# EAGLE design esp32_LoRa_radar_pelampung (EAGLE 9.6.0)
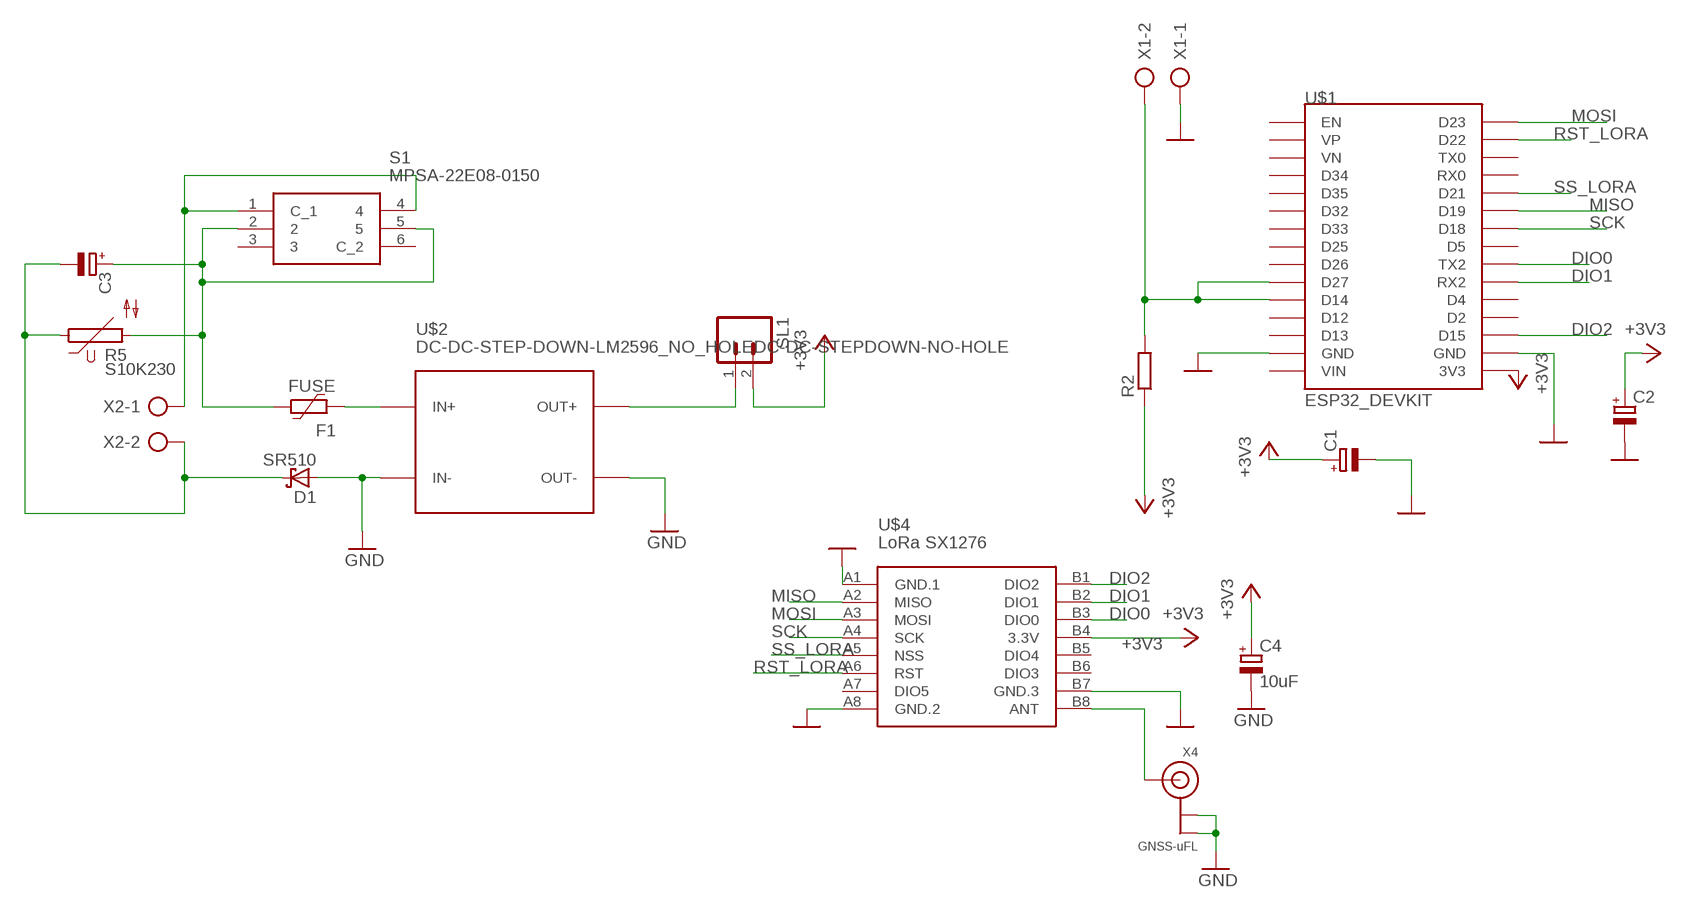
[diagram p0: schematic, sheet 1]

## Parts
C1  CPOL-EUE5-8.5  [E5-8,5]
C2  CPOL-EUE5-8.5  [E5-8,5]
C3  CPOL-EUE5-13  [E5-13]
C4  10uF  CPOL-EUE2.5-6  [E2,5-6]
D1  SR510  SCHOTTKY-DIODESMD  [SMB]
F1  FUSE  1812L010  [1812L]
R2  R-EU_0309/12  [0309/12]
R5  S10K230  [S10K230]
S1  MPSA-22E08-0150  [MPSA22E080150]
SL1  M02  [02P]
U$1  ESP32_DEVKIT  [ESP32_DEVKIT]
U$2  DC-DC-STEP-DOWN-LM2596_NO_HOLEDC-DC-STEPDOWN-NO-HOLE  [DC-DC-STEP-DOWN-LM2596_NO_HOLE]
U$4  LoRa SX1276  WIRELESS-LORA-RFM95W#SMD  [WIRELESS-LORA-RFM95W#SMD]
X1  AK300/2  [AK300/2]
X2  AK300/2  [AK300/2]
X4  GNSS-uFL  ANTENNA_U.FL  [U.FL]

## Nets
+3V3: C1.+ C2.+ C4.+ R2.1 SL1.2 U$1.3V3 U$4.B4(3.3V)
DIO0: U$1.TX2 U$4.B3(DIO0)
DIO1: U$1.RX2 U$4.B2(DIO1)
DIO2: U$1.D15 U$4.B1(DIO2)
GND: C1.- C2.- C4.- D1.A U$1.GND@1(GND) U$1.GND@2(GND) U$2.IN- U$2.OUT- U$4.A1(GND.1) U$4.A8(GND.2) U$4.B7(GND.3) X1.1 X4.1(GND) X4.2(GND)
MISO: U$1.D19 U$4.A2(MISO)
MOSI: U$1.D23 U$4.A3(MOSI)
N$2: F1.2 U$2.IN+
N$3: SL1.1 U$2.OUT+
N$4: R2.2 U$1.D14 U$1.D27 X1.2
N$6: C3.- D1.C R5.1 X2.2
N$7: S1.1(C_1) S1.4 X2.1
N$8: C3.+ F1.1 R5.2 S1.2 S1.5
N$37: U$4.B8(ANT) X4.3(SIGNAL)
RST_LORA: U$1.D22 U$4.A6(RST)
SCK: U$1.D18 U$4.A4(SCK)
SS_LORA: U$1.D21 U$4.A5(NSS)
Unconnected: S1.3 S1.6(C_2) U$1.D2 U$1.D4 U$1.D5 U$1.D12 U$1.D13 U$1.D25 U$1.D26 U$1.D32 U$1.D33 U$1.D34 U$1.D35 U$1.EN U$1.RX0 U$1.TX0 U$1.VIN U$1.VN U$1.VP U$4.A7(DIO5) U$4.B5(DIO4) U$4.B6(DIO3)

## Library data of the parts
C1-C4 = rcl:CPOL-EU: POLARIZED CAPACITOR, European symbol; SPICEPREFIX: C
D1 = diode:SCHOTTKY-DIODE: Schottky Diode
F1 = polyfuse-smd_10:?: Polyfuse Resettable PTC Source: http://www.littelfuse.com/products/resettable-ptcs.aspx; MF: Littelfuse; MPN: 1812L010; OC_FARNELL: 1822210; OC_NEWARK: 78R5551
R2 = rcl:R-EU_: RESISTOR, European symbol; SPICEPREFIX: R
R5 = varistor:S10K230: VARISTOR
S1 = MPSA-22E08-0150:MPSA-22E08-0150: DPDT Momentary-On Push Button Switch, PCB Source: Datasheet <http://www.knitter-switch.com/eng/Series/17?search=MPSA-22E08-0150>; DESCRIPTION: DPDT Momentary-On Push Button Switch, PCB; HEIGHT: 8mm; MANUFACTURER_NAME: KNITTER-SWITCH; MANUFACTURER_PART_NUMBER: MPSA-22E08-0150; RS_PART_NUMBER: 9138895; RS_PRICE-STOCK: http://uk.rs-online.com/web/p/products/9138895
SL1 = con-amp-quick:M02: AMP QUICK CONNECTOR; OC_FARNELL: unknown; OC_NEWARK: unknown
U$1 = DOIT_ESP32_DEVKIT:ESP32_DEVKIT: ESP32 DEVKIT BOARD
U$2 = diy-modules:DC-DC-STEP-DOWN-LM2596_NO_HOLE: DC/DC Step-Down Regulator based on LM2596-ADJ chip LM2596 datasheet available here: http://www.ti.com/lit/ds/symlink/lm2596.pdf Click here to find device on ebay.com <http://www.ebay.com/sch/lm2596+power+regulator>
U$4 = diy-modules:WIRELESS-LORA-RFM95W: 868/915 MHz LoRa Radio Transceiver Module based on SX1276 chip Click here to find device on ebay.com <http://www.ebay.com/sch/RFM95W+transceiver>
X1 X2 = con-ptr500:AK300/2: CONNECTOR; OC_FARNELL: unknown; OC_NEWARK: unknown
X4 = TimWoo-Connectors:ANTENNA_U.FL: U.FL Antenna Connector

## Net classes
0 default: width 0.152 mm, drill 0.152 mm, clearance 0.762 mm

## Board
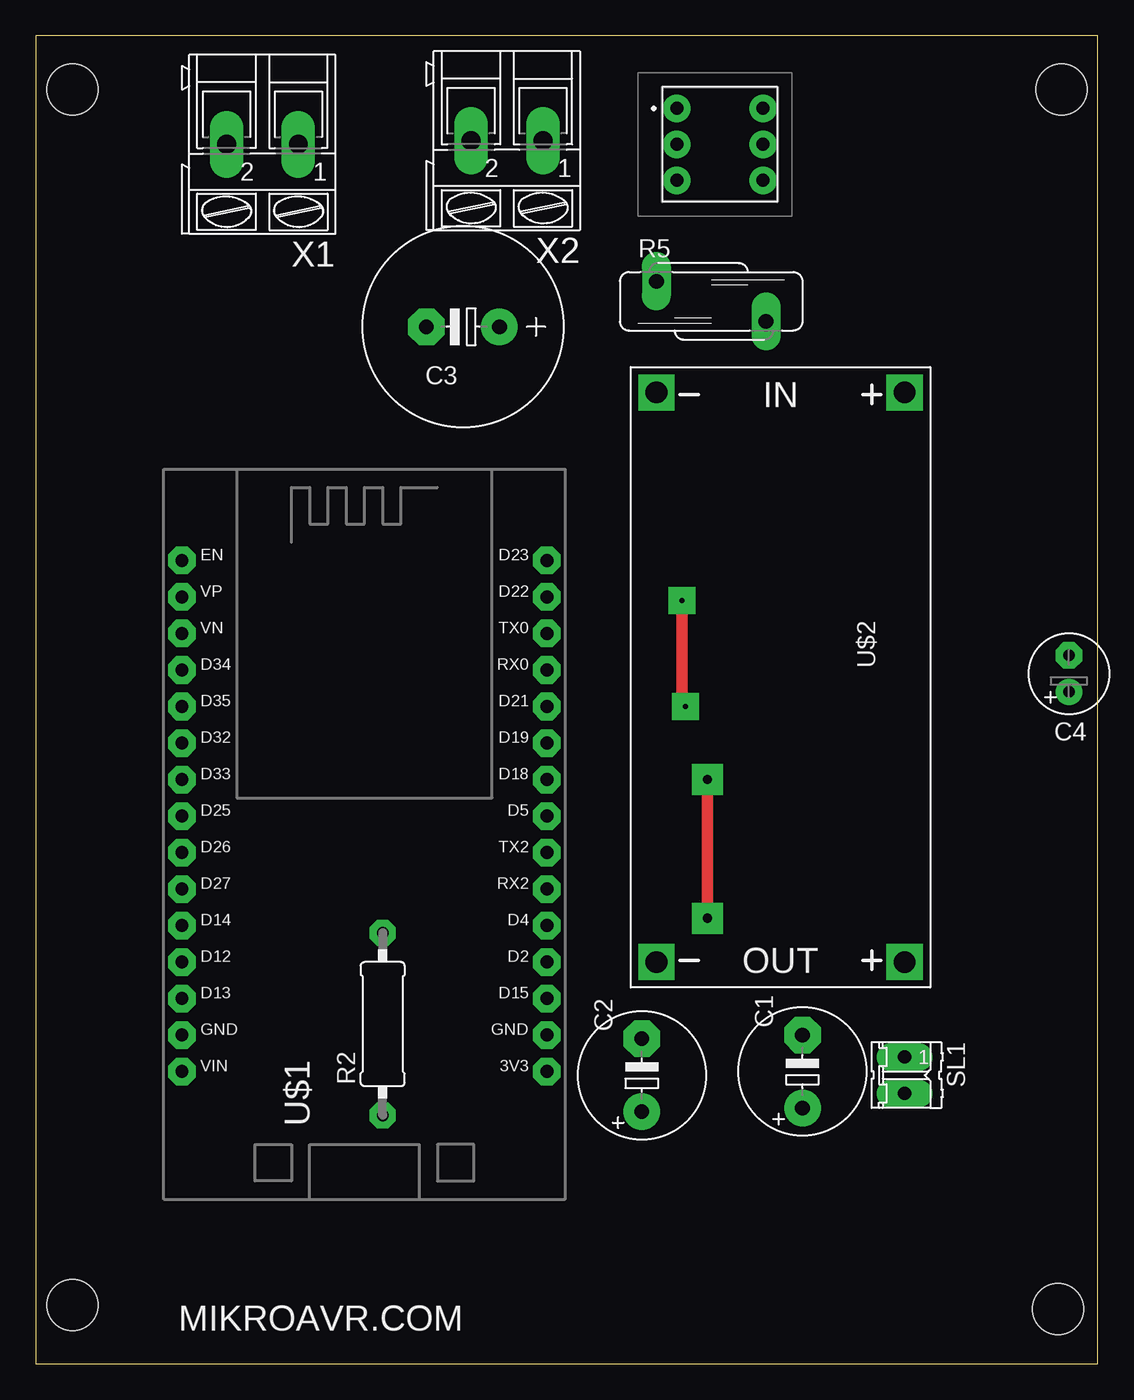
[diagram p1: board, top side]
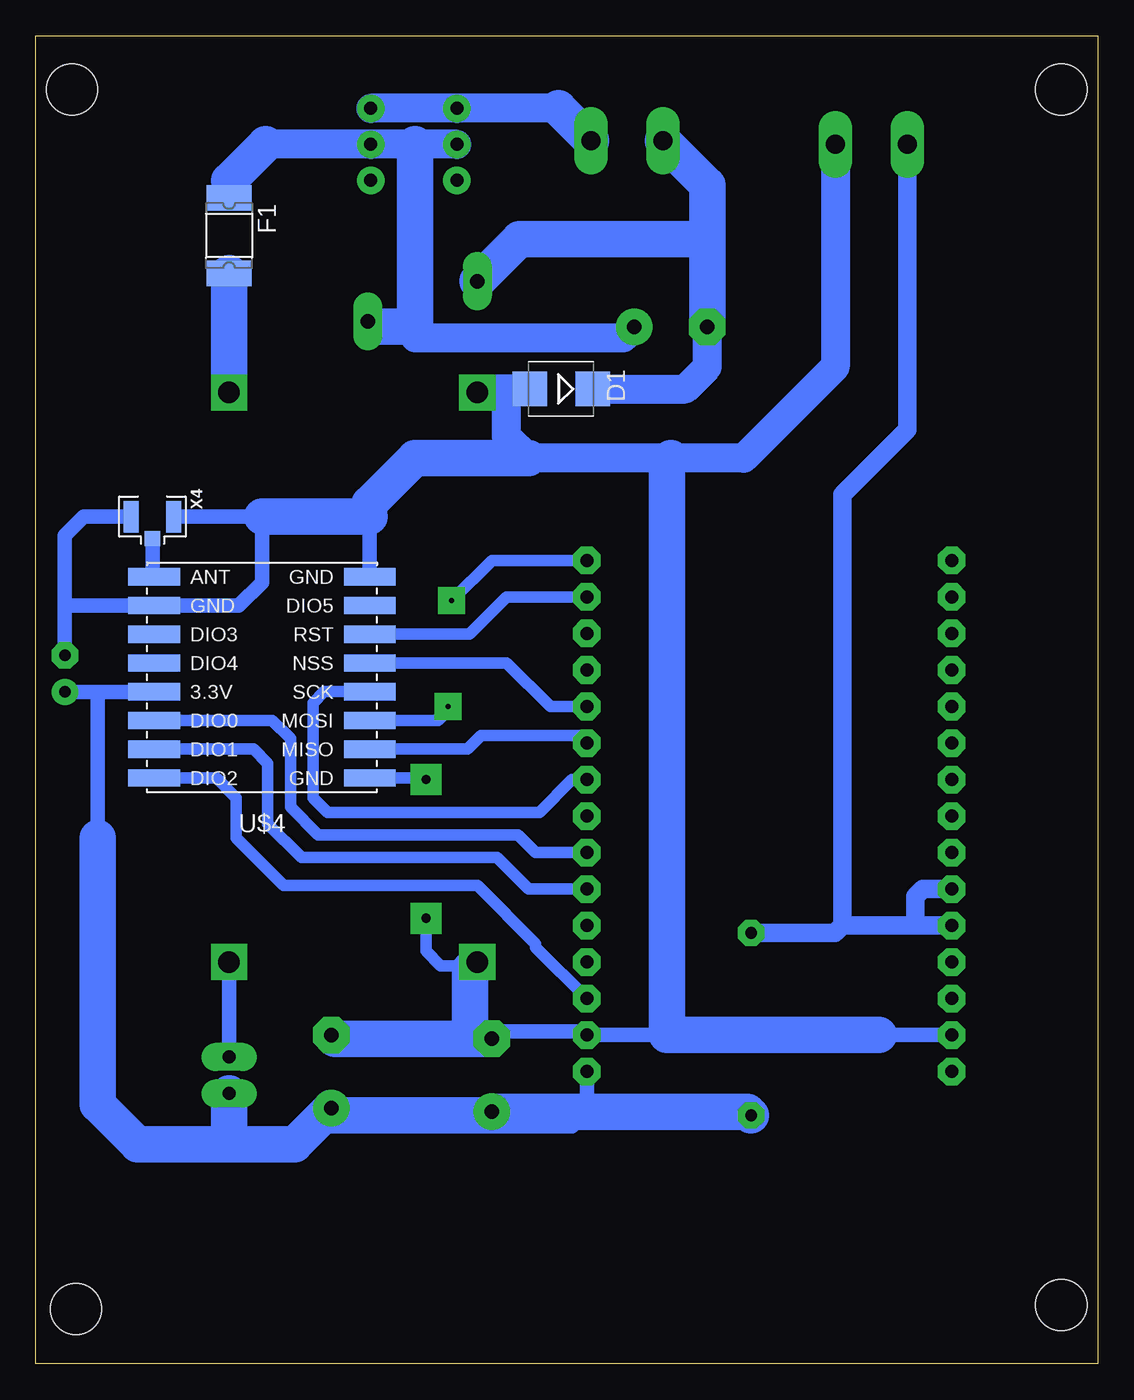
[diagram p2: board, bottom side, seen from below]

Size 73.89 x 92.38 mm. Coordinates in mm from the lower left corner, seen from the top.
Outline: 0,0 73.89,0 73.89,92.38 0,92.38 0,0
Copper layers (1*16): Top 0.035mm / dielectric 1.5mm / Bottom 0.035mm
Design rules "setting": minimum track width 30mil, minimum drill 25mil, track to track 30mil, track to pad 30mil, pad to pad 30mil, via to via 30mil, smd to smd 8mil, copper to edge 50mil, drill to drill 30mil, minimum pad ring 20mil, minimum via ring 30mil, stop-mask expansion 0mil, vias tented up to drill 0mil, thermal gap 10mil
Holes 3.56 mm at 2.54,88.65 2.54,4.06 71.12,3.81 71.37,88.65

### Footprints (pad centres in the part's own frame; a part is rotated, then mirrored left to right if it is on the bottom)
E5-8,5 = drill 1.016 pad 2.54: + -2.54,0 | drill 1.016 pad 2.54 octagon: - 2.54,0
E5-13 = drill 1.016 pad 2.54: + -2.54,0 | drill 1.016 pad 2.54 octagon: - 2.54,0
E2,5-6 = drill 0.813 pad 1.6: + -1.27,0 | drill 0.813 pad 1.6 octagon: - 1.27,0
SMB = smd 2.4 x 2.4: A 2.2,0; C -2.2,0
1812L = smd 1.78 x 3.15: 1 -2.62,0; 2 2.62,0
0309/12 = drill 0.813 octagon: 1 -6.35,0; 2 6.35,0
S10K230 = drill 1.016 long: 1 -1.397,-3.81; 2 1.397,3.81
MPSA22E080150 = drill 0.9 pad 1.4: 1 -2.5,-2.65; 2 0,-2.65; 3 2.5,-2.65; 4 -2.5,3.35; 5 0,3.35; 6 2.5,3.35
02P = drill 0.914 long: 1 -1.27,0; 2 1.27,0
ESP32_DEVKIT = drill 0.9 pad 1.422 octagon: 3V3 11.43,-17.78; D2 11.43,-10.16; D4 11.43,-7.62; D5 11.43,0; D12 -13.97,-10.16; D13 -13.97,-12.7; D14 -13.97,-7.62; D15 11.43,-12.7; D18 11.43,2.54; D19 11.43,5.08; D21 11.43,7.62; D22 11.43,15.24; D23 11.43,17.78; D25 -13.97,0; D26 -13.97,-2.54; D27 -13.97,-5.08; D32 -13.97,5.08; D33 -13.97,2.54; D34 -13.97,10.16; D35 -13.97,7.62; EN -13.97,17.78; GND@1 -13.97,-15.24; GND@2 11.43,-15.24; RX0 11.43,10.16; RX2 11.43,-5.08; TX0 11.43,12.7; TX2 11.43,-2.54; VIN -13.97,-17.78; VN -13.97,12.7; VP -13.97,15.24
DC-DC-STEP-DOWN-LM2596_NO_HOLE = drill 1.5 pad 2.5 square: IN+ -19.812,8.636; IN- -19.812,-8.636; OUT+ 19.812,8.636; OUT- 19.812,-8.636
WIRELESS-LORA-RFM95W#SMD = smd 3.6 x 1.2: A1 -7.5,7; A2 -7.5,5; A3 -7.5,3; A4 -7.5,1; A5 -7.5,-1; A6 -7.5,-3; A7 -7.5,-5; A8 -7.5,-7; B1 7.5,7; B2 7.5,5; B3 7.5,3; B4 7.5,1; B5 7.5,-1; B6 7.5,-3; B7 7.5,-5; B8 7.5,-7
AK300/2 = drill 1.321 long: 1 -2.515,0; 2 2.489,0
U.FL = smd 2.2 x 1.05: 1 0,1.475; 2 0,-1.475 | smd 1.05 x 1.05: 3 1.525,0

### Placement (x,y rotation side)
C1  53.34,20.32 90 top
C2  42.16,20.07 90 top
C3  29.72,72.14 180 top
C4  71.88,48.01 90 top
D1  37.34,67.82 180 bottom
F1  60.45,78.49 270 bottom
R2  24.13,23.62 90 top
R5  46.99,73.91 270 top
S1  47.24,84.84 270 top
SL1  60.45,20.07 270 top
U$1  24.13,38.1 0 top
U$2  51.82,47.75 270 top
U$4  58.17,47.75 180 bottom
X1  15.75,84.84 180 top
X2  32.77,85.09 180 top
X4  65.79,58.93 270 bottom

### Tracks (layer width: path | path; a pad name or v marks a point on that pad's centre or on a via)
+3V3
  Bottom 1.016: C4.+ 69.6,46.74 | 69.6,46.74 65.68,46.74 U$4.B4 | 69.6,21.84 69.6,23.37 | 69.6,36.58 69.6,46.74 | 35.56,17.53 U$1.3V3 | 60.45,15.24 55.37,15.24 53.34,17.27 C1.+ | 50.29,16.51 42.16,16.51 | 42.16,16.51 36.58,16.51 35.56,17.53 | C2.+ 42.16,16.51 | R2.1 35.31,17.27 35.56,17.53
  Bottom 2.54: 53.34,17.27 42.42,17.27 C2.+ 24.38,17.53 R2.1 | C1.+ 55.88,15.24 60.45,15.24 | 60.45,15.24 66.8,15.24 69.6,18.03 69.6,23.37 69.6,36.58 | SL1.2 60.45,15.24
DIO0
  Bottom 0.813: U$1.TX2 39.12,35.56 40.33,36.78 54.25,36.78 56.18,38.72 56.18,43.48 57.45,44.75 U$4.B3
DIO1
  Bottom 0.813: U$4.B2 58.75,42.75 57.76,41.76 57.76,37.56 55.41,35.2 41.81,35.2 39.62,33.02 U$1.RX2
DIO2
  Bottom 0.813: U$1.D15 39.12,28.96 39.12,29.21 43.18,33.27 56.64,33.27 59.94,36.58 59.94,39.37 61.33,40.75 U$4.B1
GND  (via drill 0.64)
  Top 0.813: v46.74,40.64 v46.74,30.99
  Bottom 0.813: 50.67,58.93 50.67,59.82 | U$4.A1 46.85,40.75 v46.74,40.64 | v46.74,30.99 46.74,28.7 45.72,27.69 43.43,27.69 U$2.OUT-
  Bottom 1.016: U$4.A8 50.67,58.93 | C4.- 71.88,52.83 | 71.88,52.83 71.88,57.61 70.56,58.93 X4.2 | X4.1 58.17,58.93 58.17,54.36 59.77,52.75 U$4.B7 71.8,52.75 71.88,52.83 | C1.- 53.09,23.11 43.69,23.11 43.18,23.11 | 43.18,23.11 42.42,23.11 | 42.42,23.11 35.81,23.11 U$1.GND@2 29.97,22.86 | C2.- 42.16,22.86 42.42,23.11 | U$2.OUT- 43.18,23.11 | 15.24,22.86 U$1.GND@1
  Bottom 2.032: D1.A 41.15,67.82 | 41.15,67.82 42.93,67.82 U$2.IN- | X1.1 18.26,69.37 24.64,62.99 29.72,62.99 39.62,62.99 41.15,64.52 41.15,67.82
  Bottom 2.54: 50.67,59.82 47.5,62.99 39.62,62.99 | 58.17,58.93 50.67,58.93 | C2.- 53.09,22.61 C1.- | U$2.OUT- 43.69,27.43 43.69,23.11 | 29.72,62.99 29.97,62.74 29.97,22.86 15.24,22.86
MISO
  Bottom 0.813: U$4.A2 43.86,42.75 42.93,43.69 36.07,43.69 U$1.D19
MOSI  (via drill 0.35)
  Top 0.813: v45.21,45.72 44.96,45.97 v44.96,53.09
  Bottom 0.813: U$4.A3 45.93,44.75 45.21,45.47 v45.21,45.72 | v44.96,53.09 42.16,55.88 U$1.D23
N$2
  Bottom 2.54: U$2.IN+ F1.2
N$3
  Bottom 1.016: SL1.1 U$2.OUT+
N$4
  Bottom 1.27: 12.7,30.48 U$1.D14 | U$1.D27 12.19,33.02 12.7,32.51 12.7,30.48 | X1.2 13.26,64.97 17.78,60.45 17.78,30.48 | 12.7,30.48 17.78,30.48 | 17.78,30.48 18.29,29.97 R2.2
N$6
  Bottom 1.27: 27.43,78.23 27.18,78.49
  Bottom 2.032: D1.C 28.7,67.82 27.18,69.34 C3.-
  Bottom 2.54: X2.2 27.18,81.99 27.18,78.49 C3.- | R5.1 40.26,78.23 27.43,78.23
N$7
  Bottom 2.032: S1.4 S1.1 37.53,87.34
  Bottom 2.54: X2.1 37.53,87.34
N$8
  Bottom 1.27: 50.42,72.14 R5.2 | 60.45,82.3 F1.1
  Bottom 2.032: C3.+ 33.02,71.37 47.5,71.37 47.5,72.14 | S1.2 47.5,84.84 S1.5 57.91,84.84
  Bottom 2.54: 50.42,72.14 47.5,72.14 47.5,84.84 | 57.91,84.84 60.45,82.3
N$37
  Bottom 1.016: X4.3 65.79,54.87 U$4.B8
RST_LORA
  Bottom 0.813: U$4.A6 43.74,50.75 41.15,53.34 U$1.D22
SCK
  Bottom 0.813: U$1.D18 36.58,40.64 38.86,38.35 53.59,38.35 54.61,39.37 54.61,45.97 53.83,46.75 U$4.A4
SS_LORA
  Bottom 0.813: U$1.D21 38.1,45.72 41.13,48.75 U$4.A5

### Text on the board
tPlace: MIKROAVR.COM